# Altium project iTag4.PrjPCB
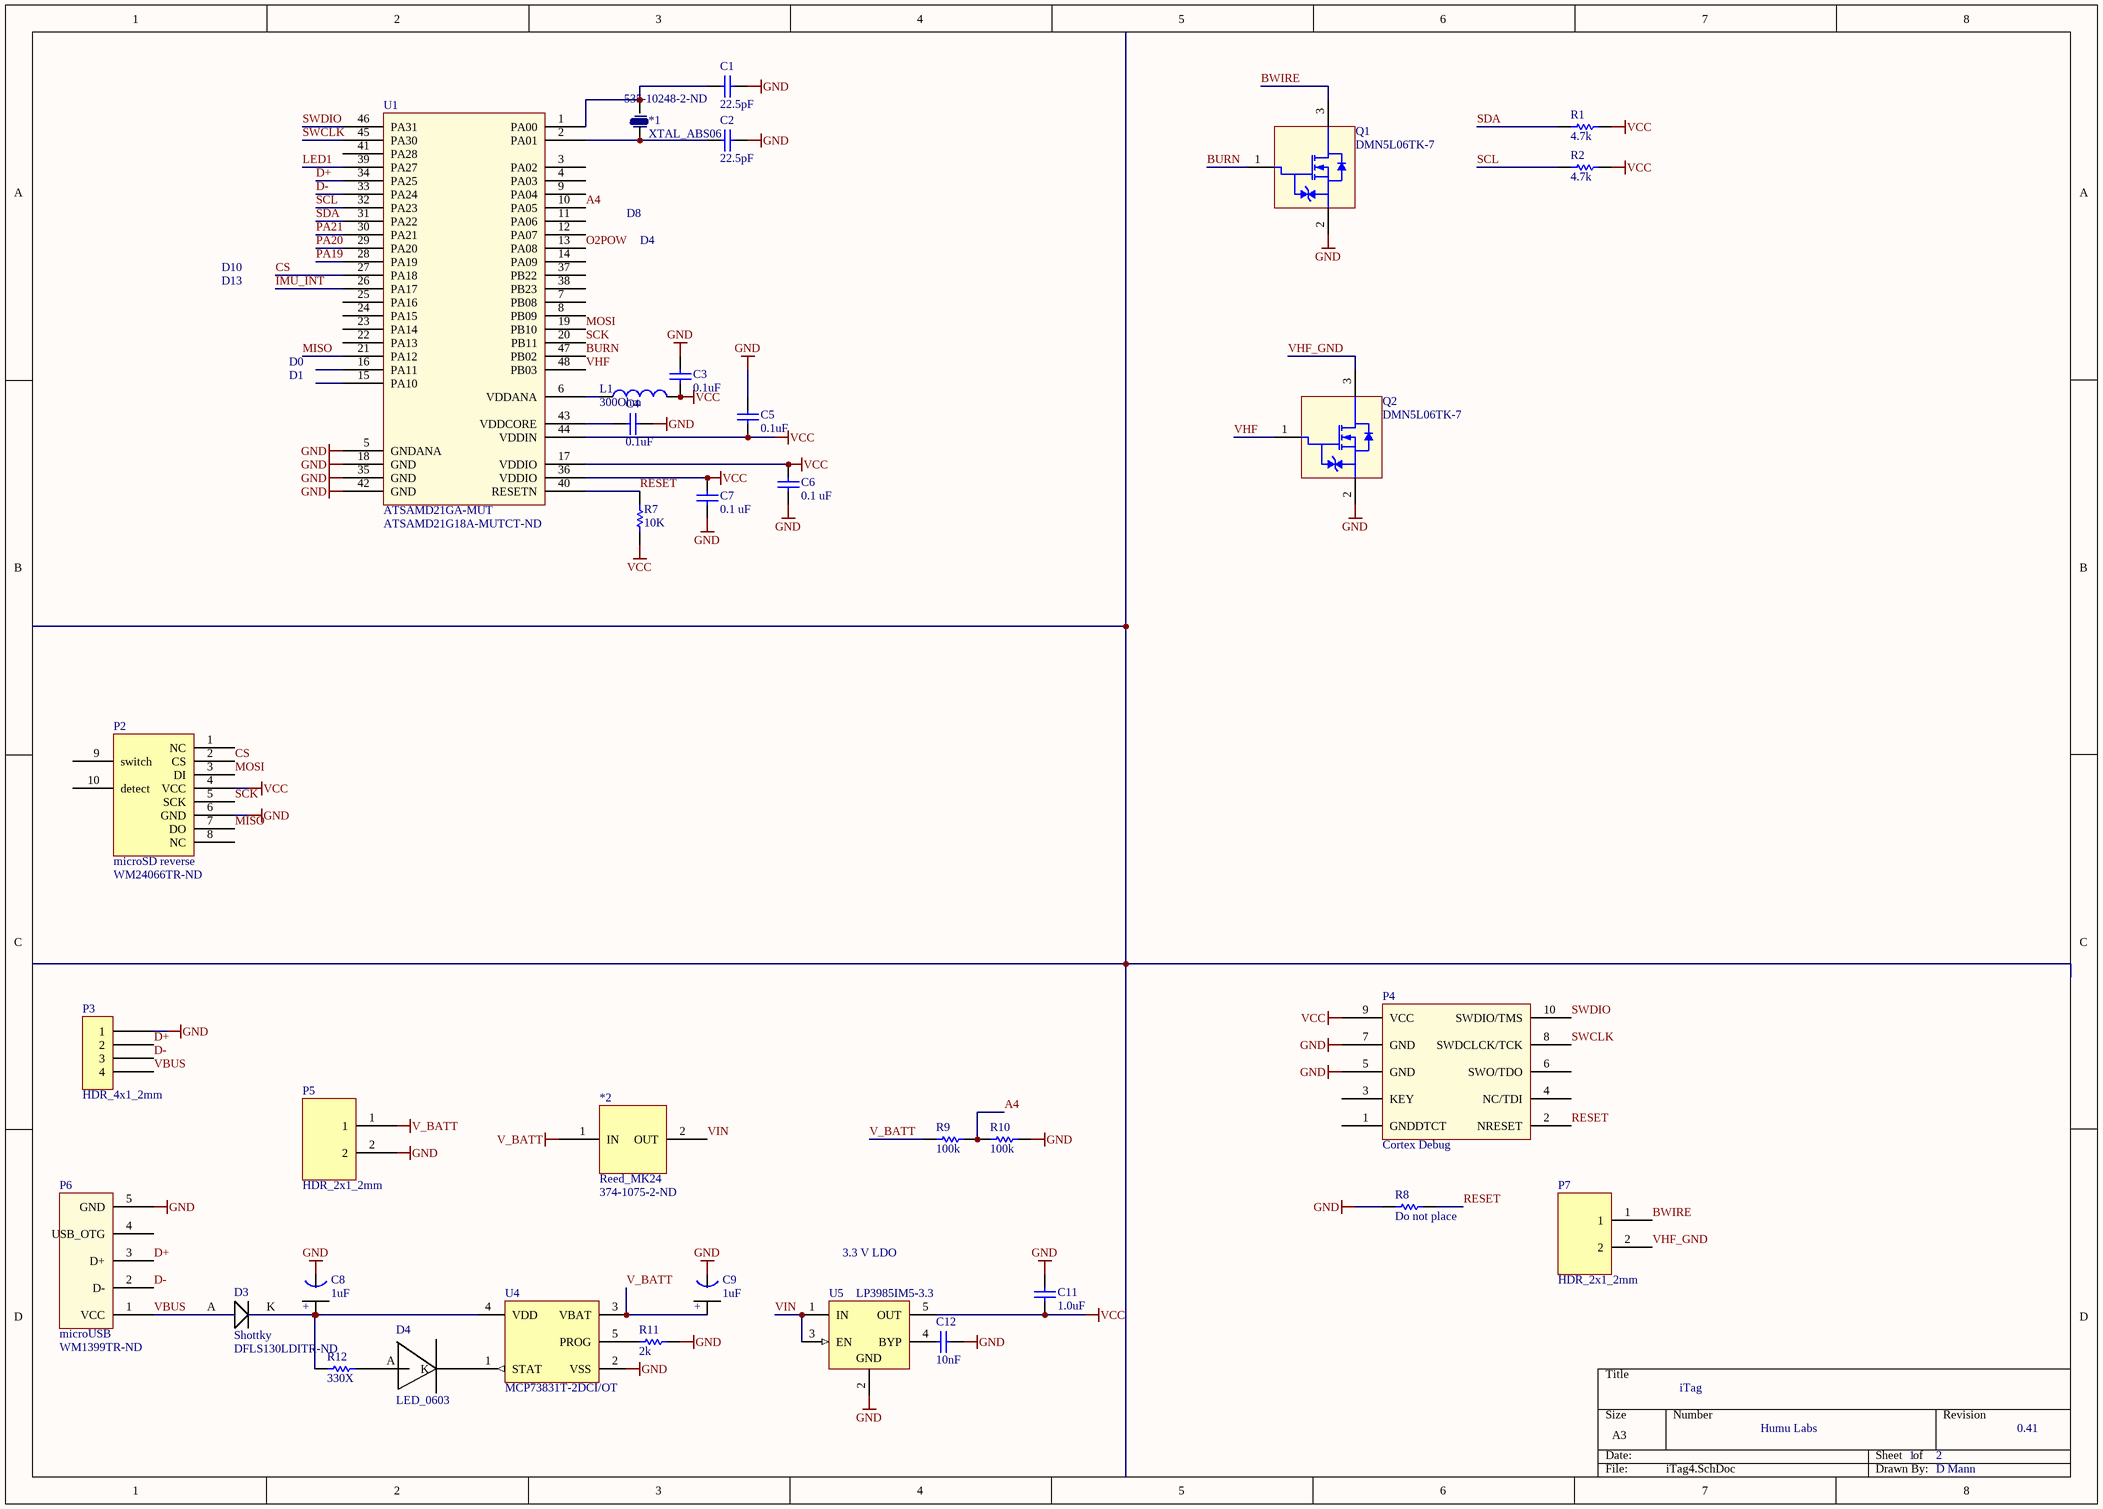
[diagram p0: iTag4.SchDoc]
2 sheets, 52 parts. Net scope: global (net labels, ports and power ports of the same name join across sheets).
Board file: iTag4.PcbDoc
Sheets:
  iTag4.SchDoc
  iTag4Sensors2.SchDoc

## Sheet iTag4.SchDoc
size A3

### Parts
*1  XTAL_ABS06  Supplier Part Number 1: 535-10248-2-ND  [XTAL-ABS06]
*2  Reed_MK24  Supplier Part Number 1: 374-1075-2-ND  [Reed MK24-B-3]
C1  22.5pF  [0402]
C2  22.5pF  [0402]
C3  0.1uF  [0402]
C4  0.1uF  [0402]
C5  0.1uF  [0402]
C6  0.1 uF  [0402]
C7  0.1 uF  [0402]
C8  1uF  [Tant0805]
C9  1uF  [Tant0805]
C11  1.0uF  [0402]
C12  10nF  [0402]
D3  Shottky  Supplier Part Number 1: DFLS130LDITR-ND  [DFLS130]
D4  LED_0603  [Diode0603]
L1  300Ohm  [0805 (M2125) Ferrite]
P2  microSD reverse  Supplier Part Number 1: WM24066TR-ND  [miroSD_reverse]
P3  HDR_4x1_2mm  [Hdr_4x1_2mm]
P4  Cortex Debug  [Header_2x5_50mil]
P5  HDR_2x1_2mm  [HDR_2x1_2mm]
P6  microUSB  Supplier Part Number 1: WM1399TR-ND  [microUSB-B]
P7  HDR_2x1_2mm  [HDR_2x1_2mm]
Q1  DMN5L06TK-7  [SOT-523]
Q2  DMN5L06TK-7  [SOT-523]
R1  4.7k  [3-0603]
R2  4.7k  [3-0603]
R7  10K  [3-0603]
R8  Do not place  [3-0603]
R9  100k  [3-0603]
R10  100k  [3-0603]
R11  2k  [3-0603]
R12  330X  [3-0603]
U1  ATSAMD21GA-MUT  Supplier Part Number 1: ATSAMD21G18A-MUTCT-ND  [QFN127P600-8N]
U4  MCP73831T-2DCI/OT  [SOT-23-OT5_N]
U5  LP3985IM5-3.3  [MF05A_N]

### Nets
GND: C1.1 C2.1 C3.2 C4.2 C5.2 C6.2 C7.2 C8.1(GND) C9.1(GND) C11.2 C12.1 P2.6(GND) P3.1 P4.5(GND) P4.7(GND) P5.2 P6.5(GND) Q1.2(S) Q2.2(S) R8.2 R10.1 R11.1 U1.5(GNDANA) U1.18(GND) U1.35(GND) U1.42(GND) U4.2(VSS) U5.2(GND)
V_BATT: *2.1(IN) C9.2(+) P5.1 R9.2 U4.3(VBAT)
VCC: C3.1 C5.1 C6.1 C7.1 C11.1 L1.2 P2.4(VCC) P4.9(VCC) R1.1 R2.2 R7.1 U1.17(VDDIO) U1.36(VDDIO) U1.44(VDDIN) U5.5(OUT)
A4: R9.1 R10.2 U1.10(PA05)
BURN: Q1.1(G) U1.47(PB02)
BWIRE: P7.1 Q1.3(D)
CS: P2.2(CS) U1.27(PA18)
D+: P3.2 P6.3(D+) U1.34(PA25)
D-: P3.3 P6.2(D-) U1.33(PA24)
IMU_INT: U1.26(PA17)
LED1: U1.39(PA27)
MISO: P2.7(DO) U1.21(PA12)
MOSI: P2.3(DI) U1.19(PB10)
O2POW: U1.13(PA08)
PA19: U1.28(PA19)
PA20: U1.29(PA20)
PA21: U1.30(PA21)
RESET: P4.2(NRESET) R7.2 R8.1 U1.40(RESETN)
SCK: P2.5(SCK) U1.20(PB11)
SCL: R2.1 U1.32(PA23)
SDA: R1.2 U1.31(PA22)
SWCLK: P4.8(SWDCLCK/TCK) U1.45(PA30)
SWDIO: P4.10(SWDIO/TMS) U1.46(PA31)
VBUS: D3.A P3.4 P6.1(VCC)
VHF: Q2.1(G) U1.48(PB03)
VHF_GND: P7.2 Q2.3(D)
VIN: *2.2(OUT) U5.1(IN) U5.3(EN)
Net*1_1: *1.1 C2.2 U1.2(PA01)
Net*1_2: *1.2 C1.2 U1.1(PA00)
NetC4_1: C4.1 U1.43(VDDCORE)
NetC8_2: C8.2(+) D3.K R12.1 U4.4(VDD)
NetD4_A: D4.A R12.2
NetD4_K: D4.K U4.1(STAT)
NetL1_1: L1.1 U1.6(VDDANA)
NetR11_2: R11.2 U4.5(PROG)

Not connected (* = marked no-connect by the designer): C12 2; P2 1(NC) 8(NC) 9(switch) 10(detect); P4 1(GNDDTCT) 3(KEY) 4(NC/TDI) 6(SWO/TDO); P6 4(USB_OTG); U1 3(PA02) 4(PA03) 7(PB08) 8(PB09) 9(PA04) 11(PA06) 12(PA07) 14(PA09) 15(PA10) 16(PA11) 22(PA13) 23(PA14) 24(PA15) 25(PA16) 37(PB22) 38(PB23) 41(PA28); U5 4(BYP)

### Notes on the sheet
- D8
- D4
- D10
- D13
- D0
- D1
- 3.3 V LDO
- iTag
- Humu Labs
- 1
- 2
- 0.41
- D Mann

### Library data of the parts
C1 C2 = C0402: Ceramic Chip Capacitor - Standard; Note: Footprint corresponds to dimensions for bulk cassette packaging. This case size has tightened tolerances.; Value: 12.5; Published: 17-Jul-2002; LatestRevisionDate: 19-Mar-2004; LatestRevisionNote: Silkscreen size reduced.; DatasheetDocument: Mar-2001; PackageDocument: Mar-2001; PackageReference: 0402; Publisher: Altium Limited; Code_JEITA: 0402; Code_IPC: 1005 [0402]; ComponentLink1Description: Manufacturer Link; ComponentLink1URL: http://www.kemet.com/; ComponentLink2Description: Datasheet; ComponentLink2URL: http://www.kemet.com/kemet/web/homepage/kechome.nsf/vapubfilesname/F3102TA.pdf/$file/F3102TA.pdf
C3-C5 C11 C12 = C0402: Ceramic Chip Capacitor - Standard; Note: Footprint corresponds to dimensions for bulk cassette packaging. This case size has tightened tolerances.; Published: 17-Jul-2002; LatestRevisionDate: 19-Mar-2004; LatestRevisionNote: Silkscreen size reduced.; DatasheetDocument: Mar-2001; PackageDocument: Mar-2001; PackageReference: 0402; Publisher: Altium Limited; Code_JEITA: 0402; Code_IPC: 1005 [0402]; ComponentLink1Description: Manufacturer Link; ComponentLink1URL: http://www.kemet.com/; ComponentLink2Description: Datasheet; ComponentLink2URL: http://www.kemet.com/kemet/web/homepage/kechome.nsf/vapubfilesname/F3102TA.pdf/$file/F3102TA.pdf
  C3-C5: Value: 0.1uF
  C11: Value: 1.0uF
  C12: Value: 10nF
C6 C7 = C0402: Ceramic Chip Capacitor - Standard; Note: Footprint corresponds to dimensions for bulk cassette packaging. This case size has tightened tolerances.; Value: 0.1uF; Published: 17-Jul-2002; LatestRevisionDate: 19-Mar-2004; LatestRevisionNote: Silkscreen size reduced.; DatasheetDocument: Mar-2001; PackageDocument: Mar-2001; PackageReference: 0402; Publisher: Altium Limited; Code_JEITA: 0402; Code_IPC: 1005 [0402]; ComponentLink1Description: Manufacturer Link; ComponentLink1URL: http://www.kemet.com/; ComponentLink2Description: Datasheet; ComponentLink2URL: http://www.kemet.com/kemet/web/homepage/kechome.nsf/vapubfilesname/F3102TA.pdf/$file/F3102TA.pdf
C8 C9 = Tant0805: Value: *
D3 = DFLS130: Supplier 1: Digi-Key
L1 = Ferrite 0805(M2125) 3A: Ferrite 25mOhm@DC,  60 Ohm@100MHz; Fabrication Tested: NO; Creator and Date: Design Engineer's Name; Footprint Verified By: *; Schematic Verified By: *; Vendor Info Verified By: *; Value: 300Ohm; HelpURL: http://www.yuden.co.jp/ut/product/pdf/mlci08_e.pdf; Mass (place origin at center): *; Supplier 1: Digi-Key; Supplier Part Number 1: 587-1932-1-ND; Supplier 2: Newark; Supplier Part Number 2: 73M9170
P4 = CortexDebug
P6 = microUSB-B: Supplier 1: Digi-Key
Q1 Q2 = FET DMN5L06TK-7: Ultra-low leakage Enhanced MOSFET; Fabrication Tested: NO; Creator and Date: Will Flanery 2010-09-02; Footprint Verified By: *; Schematic Verified By: *; Vendor Info Verified By: *; Supplier 1: Digi-Key; Supplier Part Number 1: DMN5L06TKDICT-ND; HelpURL: http://www.diodes.com/datasheets/ds30926.pdf
R1 R2 R7-R12 = ERJ3RK: Precision Thick Film Chip Resistor, 10 Ohm to 1M Ohm Range, 1% and 0.5% Tolerance, 0603 Size, 0.063 W; Published: 17-Dec-2003; LatestRevisionDate: 19-Mar-2004; LatestRevisionNote: Silkscreen size reduced.; PackageDocument: Mar-2003; PackageReference: 3-0603; Publisher: Altium Limited; Code_IPC: 1608 [0603]; ComponentLink1Description: Manufacturer Link; ComponentLink1URL: http://www.panasonic.com/industrial/components/resistive_products.htm; ComponentLink2Description: Datasheet; ComponentLink2URL: http://www.panasonic.com/industrial/components/pdf/AOA0000CE2.pdf
U1 = ATSAMD21G18: Supplier 1: Digi-Key
U4 = MCP73831T-2DCI/OT: Miniature Single-Cell, Fully Integrated Li-Ion, Li-Polymer Charge Management Controller, 4.2V, 5-Pin SOT-23, Industrial Temperature, Tape and Reel; DatasheetVersion: revE, Sep-2008; PackageVersion: revBB, Aug-2009; PackageReference: SOT-23-OT5; PackageDescription: 5-Lead Plastic Small Outline Transistor (OT) [SOT-23]; Code_IPC: SOT23-5; ComponentLink1Description: Manufacturer URL; ComponentLink1URL: http://www.microchip.com/; ComponentLink2Description: Datasheet; ComponentLink2URL: http://ww1.microchip.com/downloads/en/DeviceDoc/21984e.pdf; ComponentLink3Description: Package Specification; ComponentLink3URL: http://www.microchip.com/stellent/groups/techpub_sg/documents/packagingspec/en012702.pdf
U5 = LP3985IM5-3.3: Micropower, 150mA Low-Noise Ultra Low-Dropout CMOS Voltage Regulator, 5-pin SOT-23; Manufacturer: National Semiconductor; CompType: LDO IC; PackageTopMarking: LDQB*XTT; PowerWise: N; Published: 4-Dec-2008; DatasheetVersion: Aug-2005; PackageVersion: revD, Aug-2008; PackageReference: MF05A; Publisher: Altium Limited; PackageDescription: Molded SOT-23, .115 x .063 x .040 in Body, 5 Lead, .0375 in Pitch; PartNumber: LP3985IM5-3.3; RoHS: N; PinCount: 5; ComponentLink1Description: LP3985 Datasheet; ComponentLink1URL: http://www.national.com/ds/LP/LP3985.pdf; ComponentLink2Description: LP3985 Web Page; ComponentLink2URL: http://www.national.com/pf/LP/LP3985.html; ComponentLink3Description: MF05A Package Page; ComponentLink3URL: http://www.national.com/packaging/folders/mf05a.html; Supplier 1: Farnell; Supplier Part Number 1: 4418694
*1 = XTAL_ABS06: Supplier 1: Digi-Key
*2 = Reed_MK24: Supplier 1: Digi-Key
P2 = microSD reverse: Supplier 1: Digi-Key

## Sheet iTag4Sensors2.SchDoc
size A
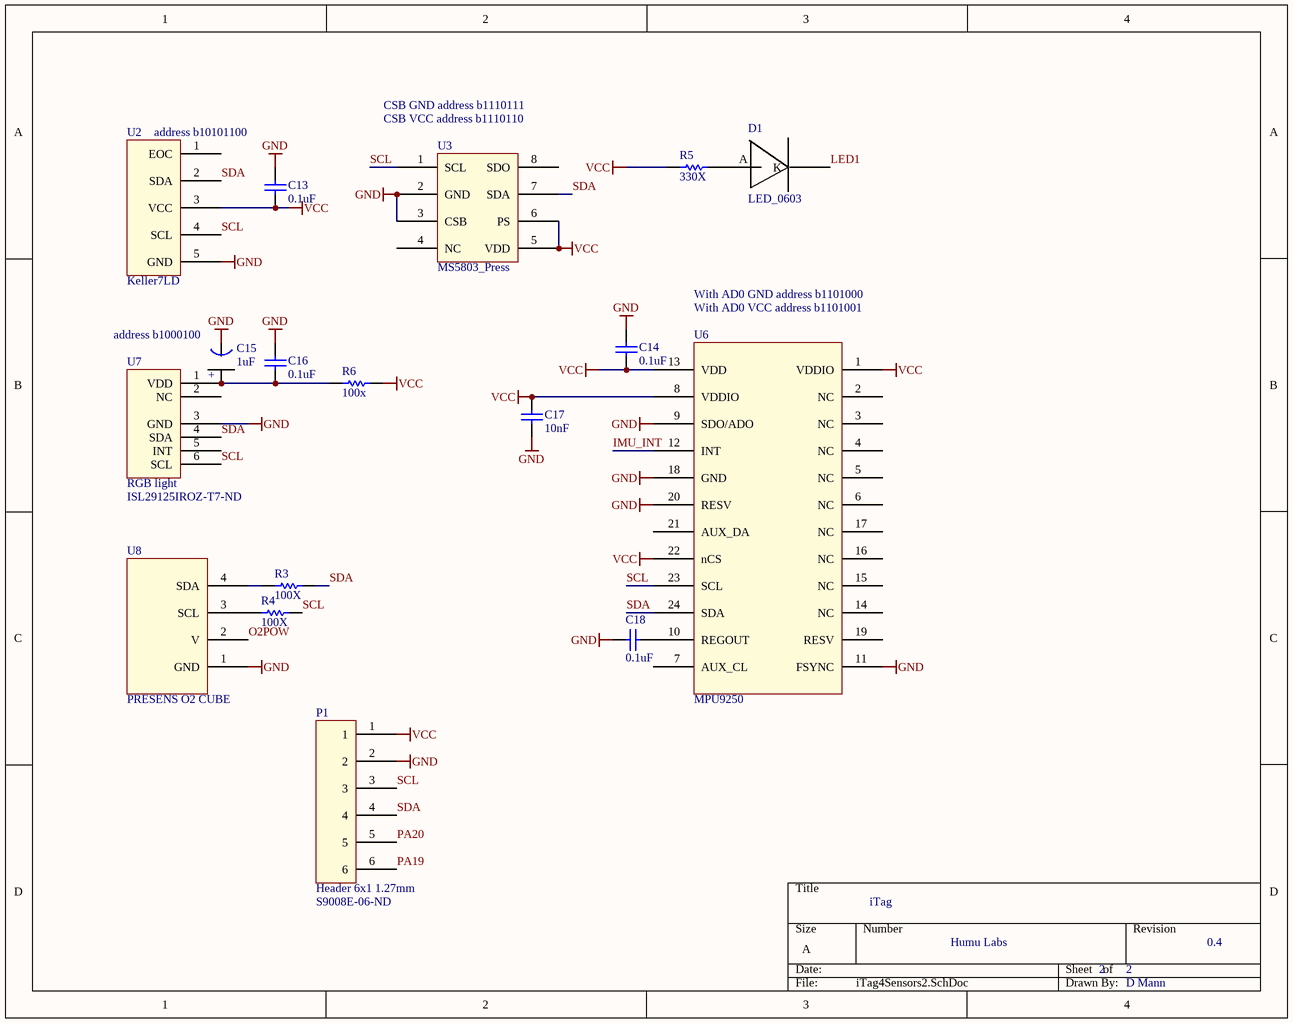
[diagram p1: iTag4Sensors2.SchDoc]

### Parts
C13  0.1uF  [0402]
C14  0.1uF  [0402]
C15  1uF  [Tant0805]
C16  0.1uF  [0402]
C17  10nF  [0402]
C18  0.1uF  [0402]
D1  LED_0603  [Diode0603]
P1  Header 6x1 1.27mm  Supplier Part Number 1: S9008E-06-ND  [Header6x1 1.27mm]
R3  100X  [3-0603]
R4  100X  [3-0603]
R5  330X  [3-0603]
R6  100x  [3-0603]
U2  Keller7LD  [Keller7LD]
U3  MS5803_Press  [MS5803_Press]
U6  MPU9250  [MPU6500]
U7  RGB light  Supplier Part Number 1: ISL29125IROZ-T7-ND  [ODFN]
U8  PRESENS O2 CUBE  [PRESENS_O2]

### Nets
GND: C13.2 C14.2 C15.1(GND) C16.2 C17.2 C18.1 P1.2 U2.5(GND) U3.2(GND) U3.3(CSB) U6.9(SDO/ADO) U6.11(FSYNC) U6.18(GND) U6.20(RESV) U7.3(GND) U8.1(GND)
VCC: C13.1 C14.1 C17.1 P1.1 R5.1 R6.1 U2.3(VCC) U3.5(VDD) U3.6(PS) U6.1(VDDIO) U6.8(VDDIO) U6.13(VDD) U6.22(nCS)
IMU_INT: U6.12(INT)
LED1: D1.K
O2POW: U8.2(V)
PA19: P1.6
PA20: P1.5
SCL: P1.3 R4.2 U2.4(SCL) U3.1(SCL) U6.23(SCL) U7.6(SCL)
SDA: P1.4 R3.2 U2.2(SDA) U3.7(SDA) U6.24(SDA) U7.4(SDA)
NetC15_2: C15.2(+) C16.1 R6.2 U7.1(VDD)
NetC18_2: C18.2 U6.10(REGOUT)
NetD1_A: D1.A R5.2
NetR3_1: R3.1 U8.4(SDA)
NetR4_1: R4.1 U8.3(SCL)

Not connected (* = marked no-connect by the designer): U2 1(EOC); U3 4(NC) 8(SDO); U6 2(NC) 3(NC) 4(NC) 5(NC) 6(NC) 7(AUX_CL) 14(NC) 15(NC) 16(NC) 17(NC) 19(RESV) 21(AUX_DA); U7 2(NC) 5(INT)

### Notes on the sheet
- (near U2) address b10101100
- CSB GND address b1110111
- (near U3) CSB VCC address b1110110
- With AD0 GND address b1101000
- (near C15) address b1000100
- With AD0 VCC address b1101001
- iTag
- Humu Labs
- 2
- 0.4
- D Mann

### Library data of the parts
C13 C14 C16-C18 = C0402: as C3 on sheet iTag4; Published: 17-Jul-2002; LatestRevisionDate: 19-Mar-2004; LatestRevisionNote: Silkscreen size reduced.; DatasheetDocument: Mar-2001; PackageDocument: Mar-2001; PackageReference: 0402; Publisher: Altium Limited; Code_JEITA: 0402; Code_IPC: 1005 [0402]; ComponentLink1Description: Manufacturer Link; ComponentLink1URL: http://www.kemet.com/; ComponentLink2Description: Datasheet; ComponentLink2URL: http://www.kemet.com/kemet/web/homepage/kechome.nsf/vapubfilesname/F3102TA.pdf/$file/F3102TA.pdf
  C13 C14 C16 C18: Value: 0.1uF
  C17: Value: 10nF
C15 = Tant0805: Value: *
R3-R6 = ERJ3RK: as R1 on sheet iTag4; Published: 17-Dec-2003; LatestRevisionDate: 19-Mar-2004; LatestRevisionNote: Silkscreen size reduced.; PackageDocument: Mar-2003; PackageReference: 3-0603; Publisher: Altium Limited; Code_IPC: 1608 [0603]; ComponentLink1Description: Manufacturer Link; ComponentLink1URL: http://www.panasonic.com/industrial/components/resistive_products.htm; ComponentLink2Description: Datasheet; ComponentLink2URL: http://www.panasonic.com/industrial/components/pdf/AOA0000CE2.pdf
U2 = Keller 7LD: Keller Pressure/Temp; PDF: http://www.kelleramerica.com/pdf-library/Piezoresistive%20OEM%20Pressure%20Transmitters%20with%20I2C%20interface%20and%20embedded%20signal%20conditioning.pdf
U6 = MPU-9250: Invensense
U7 = ISL29125: RGB light sensor; Supplier 1: Digi-Key
U8 = PRESENS_O2
P1 = Header 6x1 1.27mm: Supplier 1: Digi-Key

## Nets that join several sheets
GND: iTag4 (28 pins), iTag4Sensors2 (16 pins)
VCC: iTag4 (15 pins), iTag4Sensors2 (13 pins)
IMU_INT: iTag4 (U1.26), iTag4Sensors2 (U6.12)
LED1: iTag4 (U1.39), iTag4Sensors2 (D1.K)
O2POW: iTag4 (U1.13), iTag4Sensors2 (U8.2)
PA19: iTag4 (U1.28), iTag4Sensors2 (P1.6)
PA20: iTag4 (U1.29), iTag4Sensors2 (P1.5)
SCL: iTag4 (R2.1 U1.32), iTag4Sensors2 (6 pins)
SDA: iTag4 (R1.2 U1.31), iTag4Sensors2 (6 pins)